# EAGLE schematic staj1 (EAGLE 7.3.0)
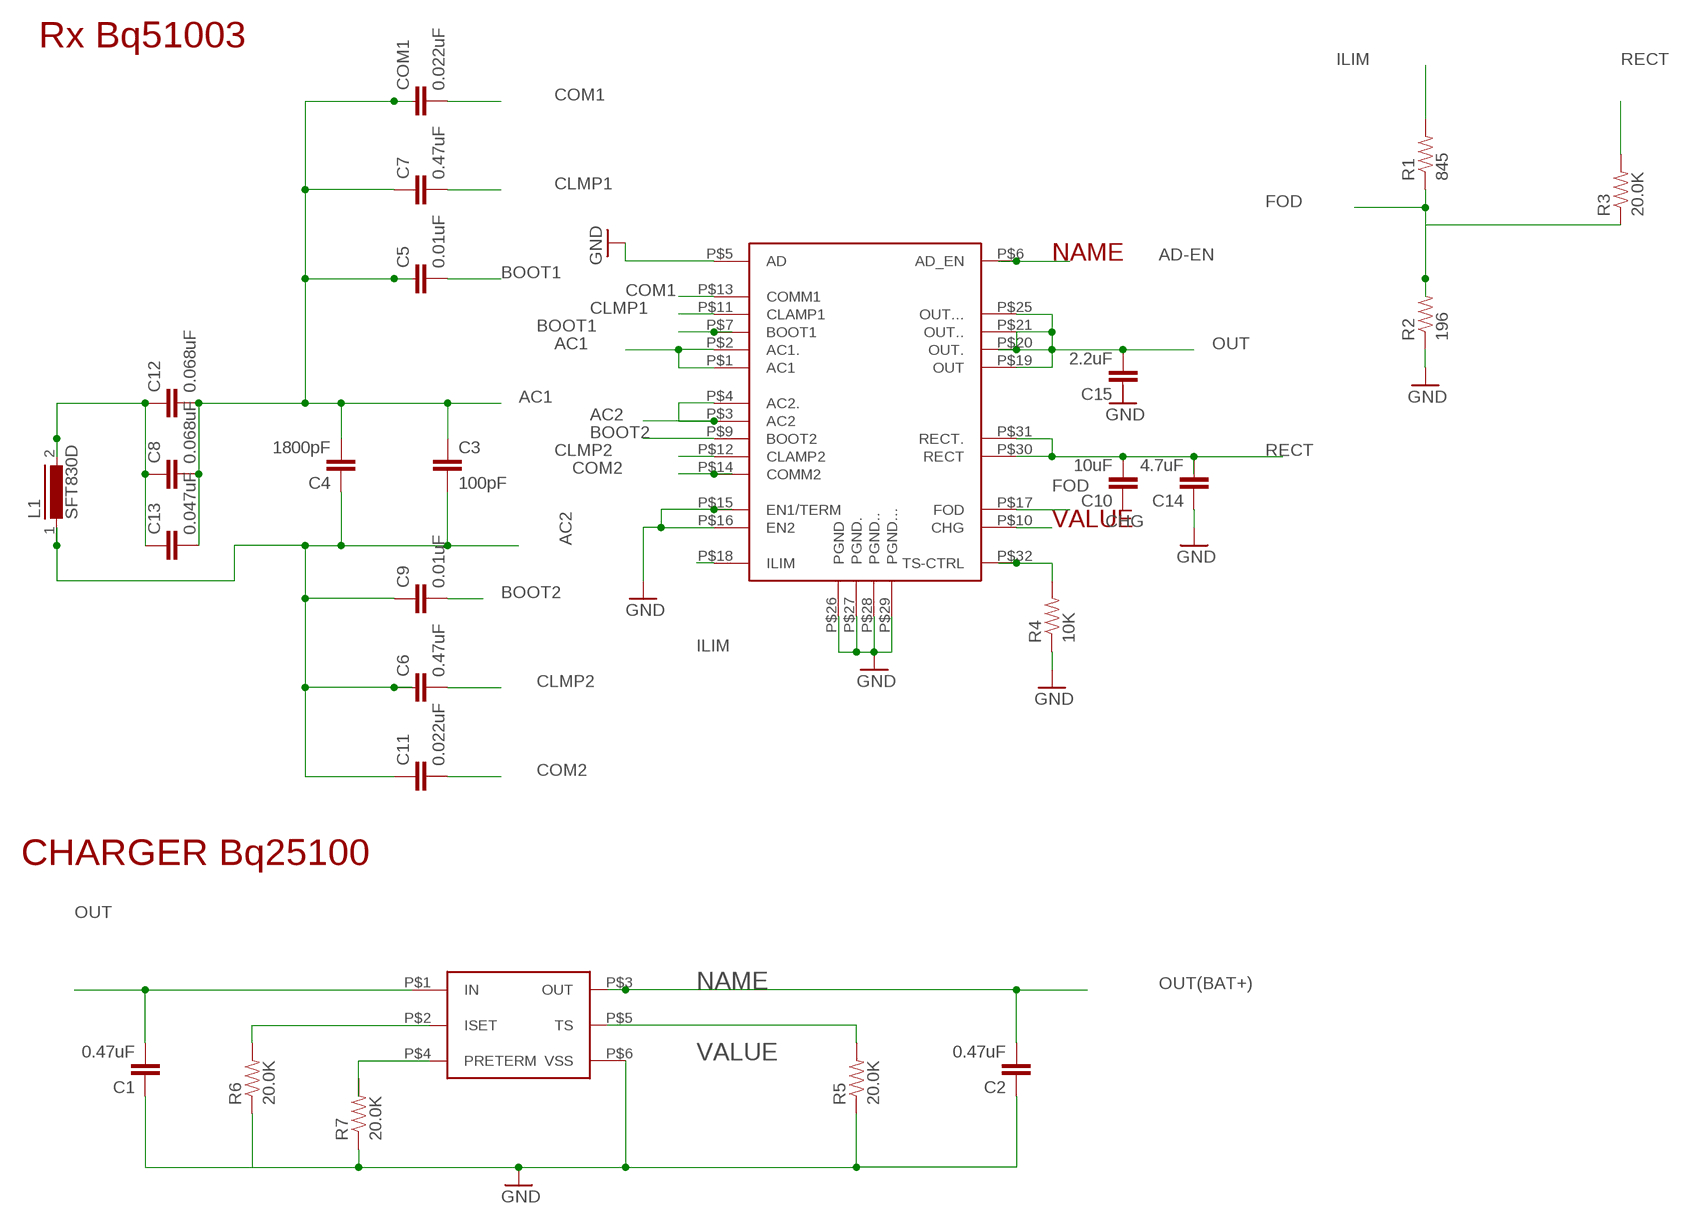
[diagram p0: schematic, sheet 1]

## Parts
C1  0.47uF  0.1UF-25V(+80/-20%)(0603)  [0603-CAP]
C2  0.47uF  0.1UF-25V(+80/-20%)(0603)  [0603-CAP]
C3  100pF  0.1UF-25V(+80/-20%)(0603)  [0603-CAP]
C4  1800pF  0.1UF-25V(+80/-20%)(0603)  [0603-CAP]
C5  0.01uF  0.1UF-25V(+80/-20%)(0603)  [0603-CAP]
C6  0.47uF  0.1UF-25V(+80/-20%)(0603)  [0603-CAP]
C7  0.47uF  0.1UF-25V(+80/-20%)(0603)  [0603-CAP]
C8  0.068uF  0.1UF-25V(+80/-20%)(0603)  [0603-CAP]
C9  0.01uF  0.1UF-25V(+80/-20%)(0603)  [0603-CAP]
C10  10uF  0.1UF-25V(+80/-20%)(0603)  [0603-CAP]
C11  0.022uF  0.1UF-25V(+80/-20%)(0603)  [0603-CAP]
C12  0.068uF  0.1UF-25V(+80/-20%)(0603)  [0603-CAP]
C13  0.047uF  0.1UF-25V(+80/-20%)(0603)  [0603-CAP]
C14  4.7uF  0.1UF-25V(+80/-20%)(0603)  [0603-CAP]
C15  2.2uF  0.1UF-25V(+80/-20%)(0603)  [0603-CAP]
COM1  0.022uF  0.1UF-25V(+80/-20%)(0603)  [0603-CAP]
L1  SFT830D  [SFT830D]
R1  845  10KOHM-1/10W-1%(0603)0603  [0603-RES]
R2  196  10KOHM-1/10W-1%(0603)0603  [0603-RES]
R3  20.0K  10KOHM-1/10W-1%(0603)0603  [0603-RES]
R4  10K  10KOHM-1/10W-1%(0603)0603  [0603-RES]
R5  20.0K  10KOHM-1/10W-1%(0603)0603  [0603-RES]
R6  20.0K  10KOHM-1/10W-1%(0603)0603  [0603-RES]
R7  20.0K  10KOHM-1/10W-1%(0603)0603  [0603-RES]
U$1  BQ51003  [BQ51003]
U$2  BQ25100  [BQ25100]

## Nets
AC1: C3.1 C4.2 C5.1 C7.1 C8.2 C12.2 C13.2 COM1.1 U$1.P$1(AC1) U$1.P$2(AC1.)
AC2: C3.2 C4.1 C6.1 C9.1 C11.1 L1.1 U$1.P$3(AC2) U$1.P$4(AC2.)
AD-EN: U$1.P$6(AD_EN)
BOOT1: C5.2 U$1.P$7(BOOT1)
BOOT2: C9.2 U$1.P$9(BOOT2)
CHG: U$1.P$10(CHG)
CLMP1: C7.2 U$1.P$11(CLAMP1)
CLMP2: C6.2 U$1.P$12(CLAMP2)
COM1: COM1.2 U$1.P$13(COMM1)
COM2: C11.2 U$1.P$14(COMM2)
FOD: R1.1 R2.2 R3.1 U$1.P$17(FOD)
GND: C1.1 C2.1 C14.1 R2.1 R4.1 R5.1 R6.1 R7.1 U$1.P$5(AD) U$1.P$15(EN1/TERM) U$1.P$16(EN2) U$1.P$26(PGND) U$1.P$27(PGND.) U$1.P$28(PGND..) U$1.P$29(PGND...) U$2.P$6(VSS)
ILIM: R1.2 U$1.P$18(ILIM)
N$2: R6.2
N$3: C8.1 C12.1 C13.1 L1.2
N$5: R5.2
N$8: R4.2 U$1.P$32(TS-CTRL)
OUT: C1.2 C15.2 U$1.P$19(OUT) U$1.P$20(OUT.) U$1.P$21(OUT..) U$1.P$25(OUT...) U$2.P$1(IN)
OUT(BAT+): C2.2 U$2.P$3(OUT)
RECT: C10.2 C14.2 R3.2 U$1.P$30(RECT) U$1.P$31(RECT.)
Unconnected: C10.1 C15.1 R7.2 U$2.P$2(ISET) U$2.P$4(PRETERM) U$2.P$5(TS)

## Notes on the sheet
- Rx Bq51003
- CHARGER Bq25100

## Library data of the parts
C1-C15 COM1 = SparkFun-Capacitors:0.1UF-25V(+80/-20%)(0603): CAP-00810 Ceramic Standard decoupling cap; PROD_ID: CAP-00810; VALUE: 0.1uF
L1 = inductors:SFT830D: INDUCTOR
R1-R3 R5-R7 = SparkFun-Resistors:10KOHM-1/10W-1%(0603): RES-00824; PROD_ID: RES-00824; VALUE: 10K
R4 = SparkFun-Resistors:10KOHM-1/10W-1%(0603): RES-00824; PROD_ID: RES-00824
U$1 = bq51003:BQ51003
U$2 = BQ25100:BQ25100